# EAGLE design LNShield (EAGLE 8.3.1)

## Sheet 1 of 2: ATMega
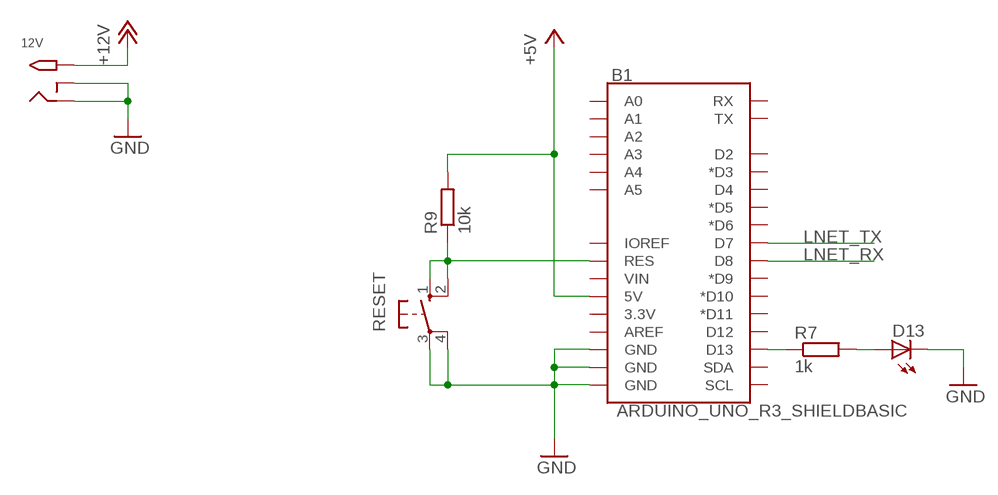
[diagram p0: schematic, sheet 1]

### Parts
12V  2.1MMJACKTHM  [PJ-102A]
B1  ARDUINO_UNO_R3_SHIELDBASIC  [UNO_R3_SHIELD]
D13  LED3MM  [LED3MM]
R7  1k  R-EU_0207/2V  [0207/2V]
R9  10k  R-EU_0207/2V  [0207/2V]
RESET  10-XX  [B3F-10XX]

### Nets
+5V: B1.5V R9.2 ; also sheet 2
+12V [power]: 12V.TIP ; also sheet 2
GND [power]: 12V.RING 12V.RING_SW B1.GND@0(GND) B1.GND@1(GND) B1.GND@2(GND) D13.K(C) RESET.3(P) RESET.4(P1) ; also sheet 2
LNET_RX: B1.D8 ; also sheet 2
LNET_TX: B1.D7 ; also sheet 2
N$2: B1.D13 R7.1
N$4: D13.A R7.2
N$14: B1.RES R9.1 RESET.1(S) RESET.2(S1)
Unconnected: B1.3.3V B1.A0 B1.A1 B1.A2 B1.A3 B1.A4 B1.A5 B1.AREF B1.D2 B1.D3(*D3) B1.D4 B1.D5(*D5) B1.D6(*D6) B1.D9(*D9) B1.D10(*D10) B1.D11(*D11) B1.D12 B1.IOREF B1.RX B1.SCL B1.SDA B1.TX B1.VIN

## Sheet 2 of 2: Loconet interface
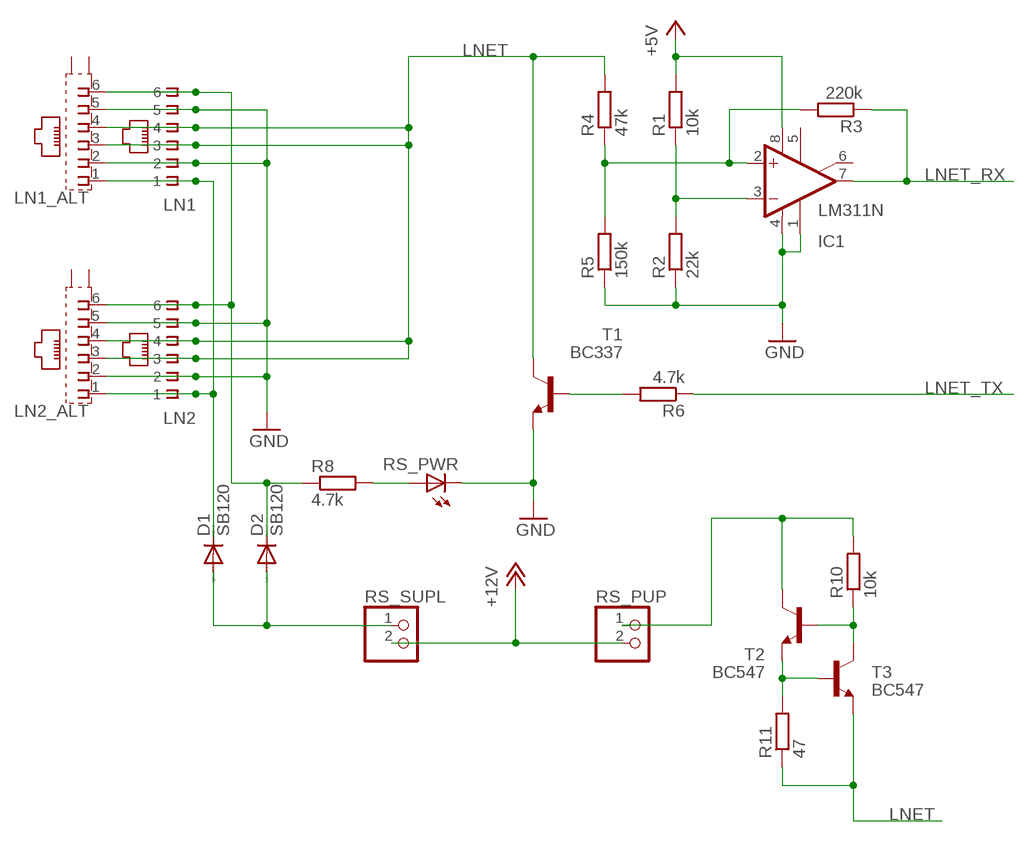
[diagram p1: schematic, sheet 2]

### Parts
D1  SB120  [DO41-10]
D2  SB120  [DO41-10]
IC1  LM311N  [DIL08]
LN1  RJ11-6X  [RJ11-NO_SHIELD]
LN1_ALT  YH-55-10  [YH-55-10]
LN2  RJ11-6X  [RJ11-NO_SHIELD]
LN2_ALT  YH-55-10  [YH-55-10]
R1  10k  R-EU_0207/2V  [0207/2V]
R2  22k  R-EU_0207/2V  [0207/2V]
R3  220k  R-EU_0207/2V  [0207/2V]
R4  47k  R-EU_0207/2V  [0207/2V]
R5  150k  R-EU_0207/2V  [0207/2V]
R6  4.7k  R-EU_0207/2V  [0207/2V]
R8  4.7k  R-EU_0207/2V  [0207/2V]
R10  10k  R-EU_0207/2V  [0207/2V]
R11  47  R-EU_0207/2V  [0207/2V]
RS_PUP  PINHD-1X2  [1X02]
RS_PWR  LED3MM  [LED3MM]
RS_SUPL  PINHD-1X2  [1X02]
T1  BC337  [TO92]
T2  BC547  [TO92]
T3  BC547  [TO92]

### Nets
+5V: IC1.8(V+) R1.2 ; also sheet 1
+12V [power]: RS_PUP.2 RS_SUPL.2 ; also sheet 1
AA [power]: D1.A D2.A RS_SUPL.1
GND [power]: IC1.1(GND) IC1.4(V-) LN1.2 LN1.5 LN1_ALT.2 LN1_ALT.5 LN2.2 LN2.5 LN2_ALT.2 LN2_ALT.5 R2.1 R5.1 RS_PWR.K(C) T1.1(E) ; also sheet 1
LNET: LN1.3 LN1.4 LN1_ALT.3 LN1_ALT.4 LN2.3 LN2.4 LN2_ALT.3 LN2_ALT.4 R4.2 R11.1 T1.3(C) T3.1(E)
LNET_RX: IC1.7(OUT) R3.1 ; also sheet 1
LNET_TX: R6.1 ; also sheet 1
N$1: R6.2 T1.2(B)
N$3: IC1.3(-IN) R1.1 R2.2
N$5: IC1.2(+IN) R3.2 R4.1 R5.2
N$6 [power]: R11.2 T2.1(E) T3.2(B)
N$7 [power]: R8.2 RS_PWR.A
N$9 [power]: R10.1 T2.2(B) T3.3(C)
N$11 [power]: R10.2 RS_PUP.1 T2.3(C)
RAILSYNC_A [power]: D2.C LN1.6 LN1_ALT.6 LN2.6 LN2_ALT.6 R8.1
RAILSYNC_B [power]: D1.C LN1.1 LN1_ALT.1 LN2.1 LN2_ALT.1
Unconnected: IC1.5(ON) IC1.6(ON/STR) LN1_ALT.S1(S) LN1_ALT.S2(S) LN2_ALT.S1(S) LN2_ALT.S2(S)

## Library data of the parts
12V = adafruit:2.1MMJACK: 2.1mm x 5.5mm THM DC jack with internal switch. Digikey part #PJ-102A, 4UCON part #05537 2.1mm x 5.5mm SMT DC jack with internal switch. Digikey part #PJ-002A-SMT, 4UCON part #03267 By microbuilder.eu & adafruit.com
B1 = SparkFun-Boards:ARDUINO_UNO_R3_SHIELD: Arduino R3 Shield Footprint Shield form compatible with the Arduino Uno R3. SparkFun Products: MG2639 Cellular Shield <https://www.sparkfun.com/products/13120> MIDI Shield <https://www.sparkfun.com/products/12898> R3 Stackable Headers Kit <https://www.sparkfun.com/products/11417>
D1 D2 = diode:SB120: DIODE barrier rectifier, 1 A (Fairchild)
D13 RS_PWR = led:LED: LED OSRAM: - CHIPLED LG R971, LG N971, LY N971, LG Q971, LY Q971, LO R971, LY R971 LH N974, LH R974 LS Q976, LO Q976, LY Q976 LO Q996 - Hyper CHIPLED LW Q18S LB Q993, LB Q99A, LB R99A - SideLED LS A670, LO A670, LY A670, LG A670, LP A670 LB A673, LV A673, LT A673, LW A673 LH A674 LY A675 LS A676, LA A676, LO A676, LY A676, LW A676 LS A679, LY A679, LG A679 - Hyper Micro SIDELED® LS Y876, LA Y876, LO Y876, LY Y876 LT Y87S - SmartLED LW L88C, LW L88S LB L89C, LB L89S, LG L890 LS L89K, LO L89K, LY L89K LS L896, LA L896, LO L896, LY L896 - TOPLED LS T670, LO T670, LY T670, LG T670, LP T670 LSG T670, LSP T670, LSY T670, LOP T670, LYG T670 LG T671, LOG T671, LSG T671 LB T673, LV T673, LT T673, LW T673 LH T674 LS T676, LA T676, LO T676, LY T676, LB T676, LH T676, LSB T676, LW T676 LB T67C, LV T67C, LT T67C, LS T67K, LO T67K, LY T67K, LW E67C LS E67B, LA E67B, LO E67B, LY E67B, LB E67C, LV E67C, LT E67C LW T67C LS T679, LY T679, LG T679 LS T770, LO T770, LY T770, LG T770, LP T770 LB T773, LV T773, LT T773, LW T773 LH T774 LS E675, LA E675, LY E675, LS T675 LS T776, LA T776, LO T776, LY T776, LB T776 LHGB T686 LT T68C, LB T68C - Hyper Mini TOPLED® LB M676 - Mini TOPLED Santana® LG M470 LS M47K, LO M47K, LY M47K Source: http://www.osram.convergy.de LUXEON: - LUMILED® LXK2-PW12-R00, LXK2-PW12-S00, LXK2-PW14-U00, LXK2-PW14-V00 LXK2-PM12-R00, LXK2-PM12-S00, LXK2-PM14-U00 LXK2-PE12-Q00, LXK2-PE12-R00, LXK2-PE12-S00, LXK2-PE14-T00, LXK2-PE14-U00 LXK2-PB12-K00, LXK2-PB12-L00, LXK2-PB12-M00, LXK2-PB14-N00, LXK2-PB14-P00, LXK2-PB14-Q00 LXK2-PR12-L00, LXK2-PR12-M00, LXK2-PR14-Q00, LXK2-PR14-R00 LXK2-PD12-Q00, LXK2-PD12-R00, LXK2-PD12-S00 LXK2-PH12-R00, LXK2-PH12-S00 LXK2-PL12-P00, LXK2-PL12-Q00, LXK2-PL12-R00 Source: www.luxeon.com KINGBRIGHT: KA-3528ASYC Source: www.kingbright.com
IC1 = linear:LM311: COMPARATOR
LN1 LN2 = con-tycoelectronics:RJ11: CORCOM Modular RJ Jacks No Shield Source: www.tycoelectronics.com .. ENG_DS_1654001_1099_RJ_L_0507.pdf; MPN: RJ11-6X; OC_FARNELL: unknown; OC_NEWARK: 16R6089
LN1_ALT LN2_ALT = con-wenzhou-yihua:YH-55-10: RJ11 6 connects Source: YH-55-10.pdf; OC_FARNELL: unknown; OC_NEWARK: unknown
R1-R11 = rcl:R-EU_: RESISTOR, European symbol
RESET = switch-omron:10-XX: OMRON SWITCH; MPN: B3F-1000; OC_FARNELL: 176432; OC_NEWARK: 36M3542
RS_PUP RS_SUPL = pinhead:PINHD-1X2: PIN HEADER
T1 = transistor:BC337: NPN TRANSISTOR
T2 T3 = transistor:BC547: NPN TRANSISTOR

## Net classes
0 default: width 0.254 mm
1 power: width 1.016 mm

## Board
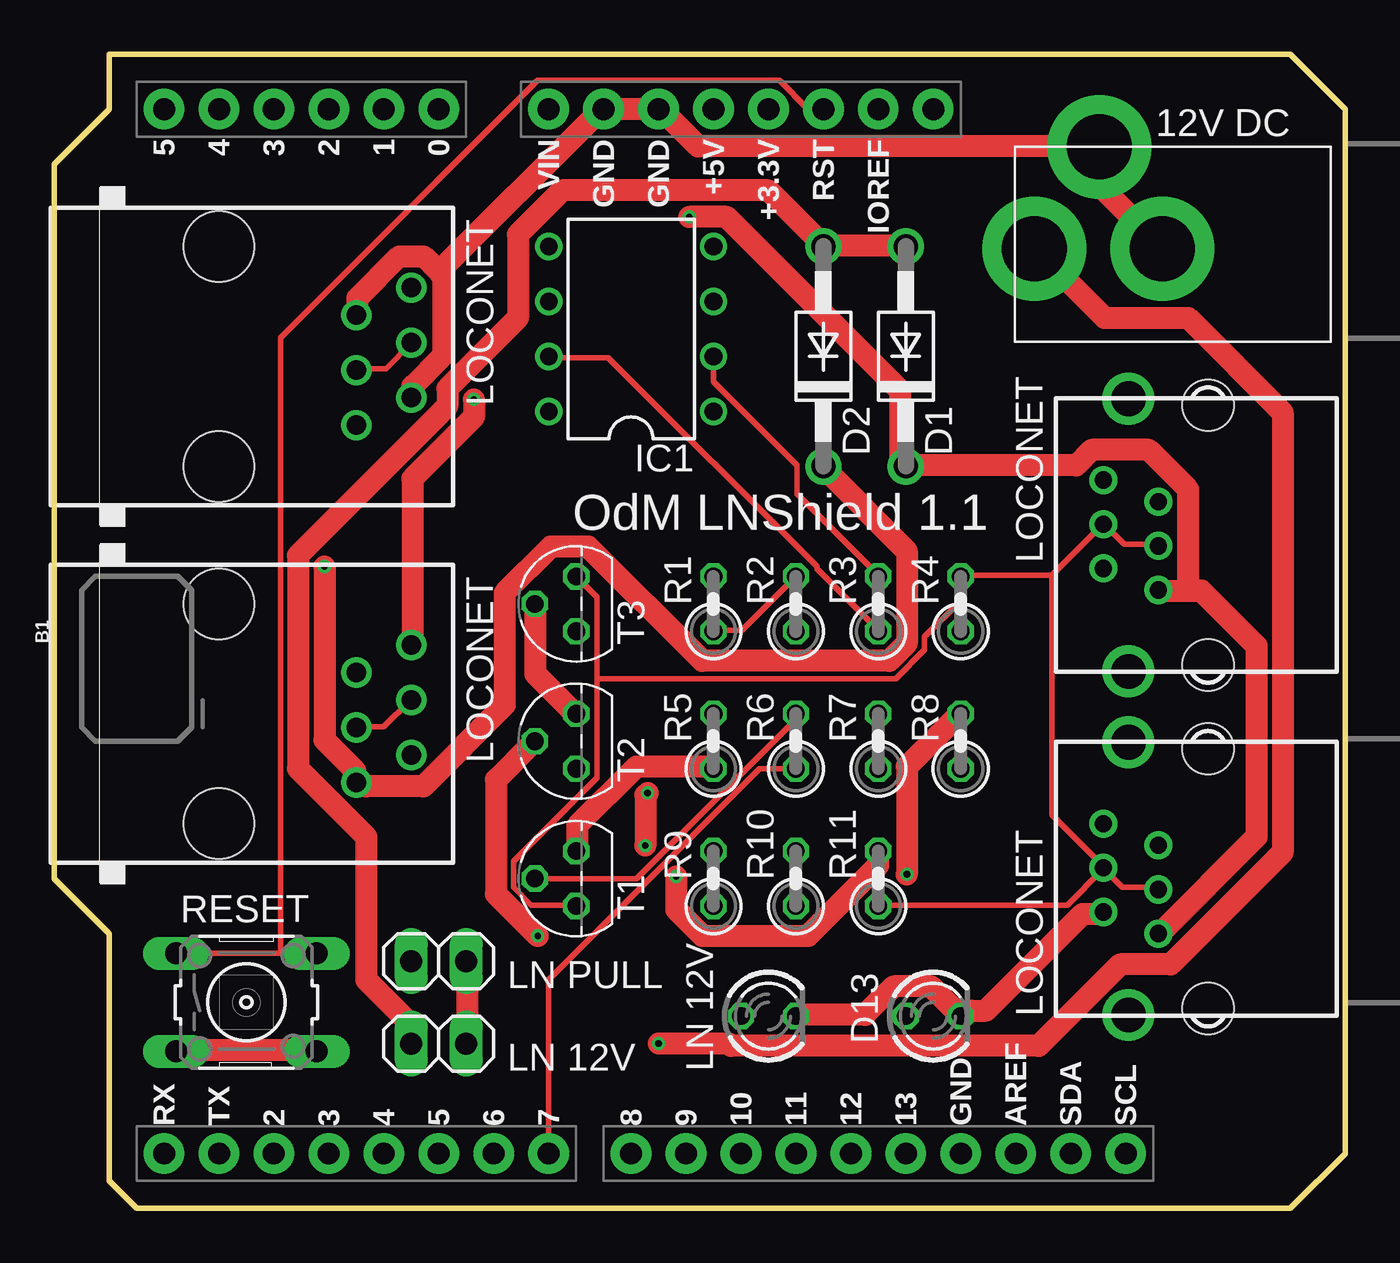
[diagram p2: board, top side]
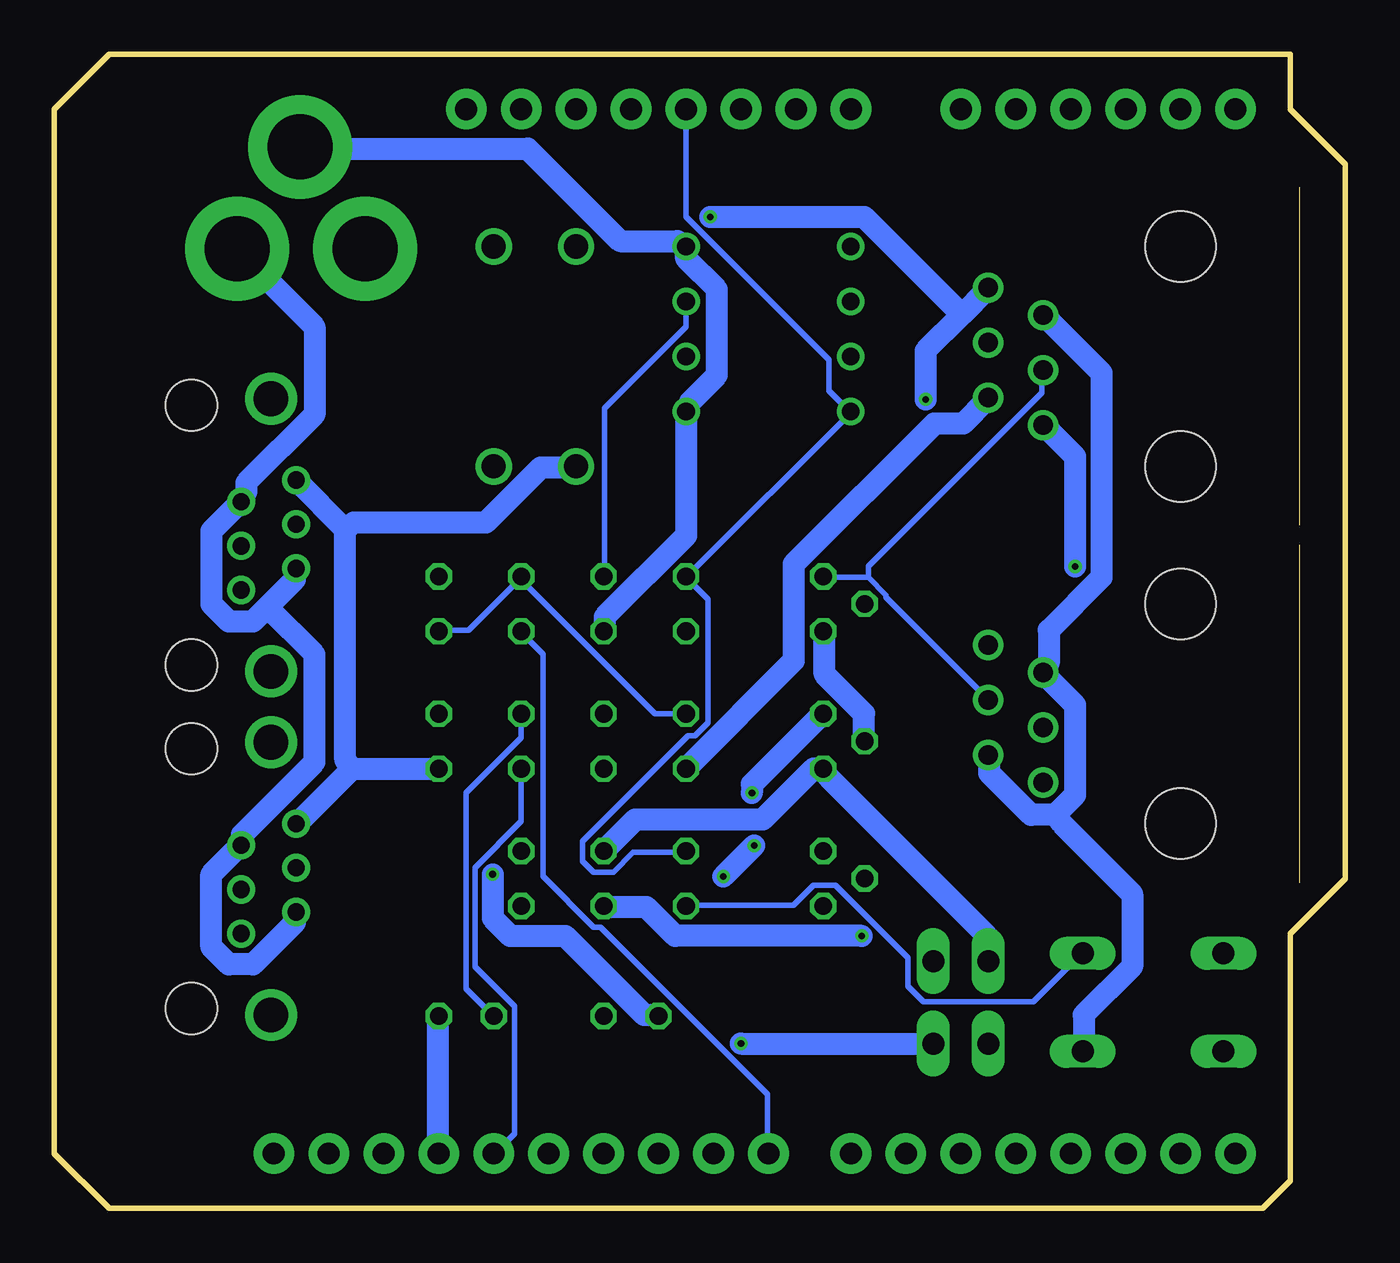
[diagram p3: board, bottom side, seen from below]

Size 59.69 x 53.34 mm. Coordinates in mm from the lower left corner, seen from the top.
Outline: 2.54,53.34 57.15,53.34 59.69,50.8 59.69,2.54 57.15,0 3.81,0 2.54,1.27 2.54,12.7 0,15.24 0,48.26 2.54,50.8 2.54,53.34
Copper layers (1*16): Top 0.035mm / dielectric 1.6mm / Bottom 0.035mm
Design rules "Elecrow_2-layer_PCB_eagle_rule": minimum track width 6mil, minimum drill 12mil, track to track 6mil, track to pad 8mil, pad to pad 12mil, via to via 12mil, smd to smd 0mil, copper to edge 20mil, drill to drill 10mil, minimum pad ring 6mil, minimum via ring 6mil, stop-mask expansion 0mil, vias tented up to drill 100mil, thermal gap 10mil

### Footprints (pad centres in the part's own frame; a part is rotated, then mirrored left to right if it is on the bottom)
PJ-102A = drill 3 pad 4.8: RING 0.1,-3.39; RING_SW -4.6,-6.29; TIP 0.1,-9.29
UNO_R3_SHIELD = drill 1.016 pad 1.88: 3.3V 24.13,-2.54; 5V 24.13,0; A0 24.13,12.7; A1 24.13,15.24; A2 24.13,17.78; A3 24.13,20.32; A4 24.13,22.86; A5 24.13,25.4; AREF -24.13,-13.97; D2 -24.13,20.32; D3 -24.13,17.78; D4 -24.13,15.24; D5 -24.13,12.7; D6 -24.13,10.16; D7 -24.13,7.62; D8 -24.13,3.81; D9 -24.13,1.27; D10 -24.13,-1.27; D11 -24.13,-3.81; D12 -24.13,-6.35; D13 -24.13,-8.89; GND@0 24.13,2.54; GND@1 24.13,5.08; GND@2 -24.13,-11.43; IOREF 24.13,-7.62; NC 24.13,-10.16; RES 24.13,-5.08; RX -24.13,25.4; SCL -24.13,-19.05; SDA -24.13,-16.51; TX -24.13,22.86; VIN 24.13,7.62
DO41-10 = drill 1.118: A 5.08,0; C -5.08,0
LED3MM = drill 0.813 octagon: A -1.27,0; K 1.27,0
DIL08 = drill 0.813 pad 1.27: 1 -3.81,-3.81; 2 -1.27,-3.81; 3 1.27,-3.81; 4 3.81,-3.81; 5 3.81,3.81; 6 1.27,3.81; 7 -1.27,3.81; 8 -3.81,3.81
RJ11-NO_SHIELD = drill 0.9 pad 1.4: 1 -3.175,8.89; 2 -1.905,6.35; 3 -0.635,8.89; 4 0.635,6.35; 5 1.905,8.89; 6 3.175,6.35 | hole 3.251: -5.08,0; 5.08,0
YH-55-10 = drill 0.8 pad 1.3: 1 -2.54,2.3; 2 -1.54,4.84; 3 -0.5,2.3; 4 0.5,4.84; 5 1.54,2.3; 6 2.54,4.84 | drill 1.6 pad 2.184: S1 -6.3,3.68; S2 6.3,3.68 | hole 2.36: -6,0; 6,0
0207/2V = drill 0.813 octagon: 1 -1.27,0; 2 1.27,0
B3F-10XX = drill 1.016 long: 1 -3.251,2.261; 2 3.251,2.261; 3 -3.251,-2.261; 4 3.251,-2.261
1X02 = drill 1.016 long: 1 -1.27,0; 2 1.27,0
TO92 = drill 0.813 octagon: 1 1.27,0; 2 0,1.905; 3 -1.27,0

### Placement (x,y rotation side)
12V  54.61,44.45 270 top
B1  30.48,26.67 90 top
D1  39.37,39.37 90 top
D2  35.56,39.37 90 top
D13  40.64,8.89 0 top
IC1  26.67,40.64 90 top
LN1  7.62,39.37 270 top
LN1_ALT  53.34,31.11 90 top
LN2  7.62,22.86 270 top
LN2_ALT  53.34,15.24 90 top
R1  30.48,27.94 90 top
R2  34.29,27.94 90 top
R3  38.1,27.94 90 top
R4  41.91,27.94 90 top
R5  30.48,21.59 90 top
R6  34.29,21.59 90 top
R7  38.1,21.59 90 top
R8  41.91,21.59 90 top
R9  30.48,15.24 90 top
R10  34.29,15.24 90 top
R11  38.1,15.24 90 top
RESET  8.89,9.53 0 top
RS_PUP  17.78,11.43 0 top
RS_PWR  33.02,8.89 0 top
RS_SUPL  17.78,7.62 0 top
T1  24.13,15.24 90 top
T2  24.13,21.59 90 top
T3  24.13,27.94 90 top

### Tracks (layer width: path | path; a pad name or v marks a point on that pad's centre or on a via)
+5V
  Bottom 0.254: R9.2 30.48,16.46 32.92,16.46 33.83,15.54 34.75,15.54 35.26,16.05 35.26,16.97 30.38,21.84 30.07,21.84 29.46,22.45 29.46,28.14 30.48,29.16 R1.2 30.38,29.26 22.86,36.78 IC1.8 22.96,36.88 23.88,37.8 23.88,39.22 30.48,45.82 B1.5V
+12V  (via drill 0.3)
  Top 1.016: RS_SUPL.2 19.1,7.62 19.1,11.38 RS_PUP.2 | v27.94,7.62 31.19,7.62 31.29,7.52 45.52,7.52 49.28,11.28 51.61,11.28 56.79,16.46 56.79,36.78 52.43,41.15 48.56,41.15 45.41,44.3 12V.TIP
  Bottom 1.016: v27.94,7.62 RS_SUPL.2
AA
  Top 1.016: RS_SUPL.1 16.46,7.62 16.46,8.53 14.43,10.57 14.43,17.17 11.28,20.32 11.28,30.18 18.19,37.08 18.19,37.9 21.44,41.15 21.44,45.01 23.47,47.04 33.02,47.04 35.56,44.5 D2.A 35.97,44.5 39.32,44.5 D1.A
GND
  Top 1.016: RESET.3 5.69,7.32 12.09,7.32 RESET.4 | R5.1 30.38,20.42 26.92,20.42 24.18,17.68 24.18,16.56 T1.1 | 17.78,43.28 17.07,43.99 15.95,43.99 14.02,42.06 14.02,41.35 LN1.2 | 17.78,43.28 17.98,43.08 17.98,39.42 16.56,38 16.56,37.49 LN1.5 | 17.78,43.28 24.99,50.49 B1.GND@1 B1.GND@0 28.35,50.49 29.77,49.07 47.85,49.07 12V.RING_SW 48.36,48.97 48.36,47.24 51.21,44.4 12V.RING | RS_PWR.K 34.34,8.94 37.49,8.94 38.81,10.26 40.54,10.26 D13.K 42.37,9.14 43.08,9.14 47.55,13.61 48.46,13.61 LN2_ALT.2
  Bottom 1.016: 13.41,18.19 14.53,18.19 16.46,20.12 16.46,20.93 LN2.5 | 13.41,18.19 12.5,19.1 12.5,23.27 13.92,24.69 LN2.2 13.72,25.2 13.72,26.72 11.28,29.16 11.28,38.61 13.92,41.25 LN1.2 | RESET.4 12.09,7.32 12.09,8.94 9.86,11.18 9.86,14.53 13.11,17.78 13.41,18.19 | R5.1 25.5,25.3 25.5,29.77 19,36.27 17.68,36.27 16.56,37.39 LN1.5 | 49.84,27.79 50.49,27.13 51.61,27.13 52.43,27.94 52.43,31.29 51.1,32.61 LN1_ALT.5 50.8,33.12 50.8,33.53 47.65,36.68 47.65,40.74 51.21,44.3 12V.RING | 49.84,27.79 48.56,29.06 48.56,29.57 LN1_ALT.2 | LN2_ALT.2 48.56,13.61 48.56,13.21 50.49,11.28 51.61,11.28 52.43,12.09 52.43,15.44 51.1,16.76 LN2_ALT.5 51,17.27 47.65,20.62 47.65,25.6 49.84,27.79 | B1.GND@2 41.96,2.54 41.96,8.84 D13.K | R2.1 34.24,26.72 34.24,27.33 30.48,31.09 IC1.1 30.28,37.29 29.06,38.51 29.06,42.47 30.48,43.89 IC1.4 30.89,44.7 33.53,44.7 37.8,48.97 48.26,48.97 12V.RING_SW
LNET
  Top 0.254: 46.13,29.26 41.96,29.26 R4.2 41.86,29.16 41.86,28.04 40.23,26.42 40.23,25.81 38.91,24.49 25.09,24.49 | 46.13,29.26 48.46,31.6 LN1_ALT.4 48.56,31.6 49.48,30.68 51,30.68 LN1_ALT.3 | R11.1 38.1,14.02 46.84,14.02 48.46,15.65 LN2_ALT.4 | LN2_ALT.3 51,14.83 49.38,14.83 48.56,15.65 LN2_ALT.4 | 46.13,29.26 46.13,18.19 48.46,15.85 LN2_ALT.4 | LN1.4 14.02,38.81 15.34,38.81 16.46,39.93 LN1.3 | LN2.4 14.02,22.25 15.24,22.25 16.46,23.47 LN2.3 | 25.09,24.49 25.09,28.25 T3.1 | 25.09,24.49 25.09,19.91 21.23,16.05 21.23,14.83 22.05,14.02 24.08,14.02 T1.3
  Bottom 0.254: 22.05,29.16 21.23,28.35 21.23,28.25 16.56,23.57 LN2.3 | 22.05,29.16 24.08,29.16 T3.1 | 22.05,29.16 22.05,29.67 14.02,37.69 14.02,38.71 LN1.4
LNET_RX
  Top 0.254: R3.1 38.1,26.72 35.26,29.57 35.26,29.67 25.6,39.32 22.86,39.32 IC1.7
  Bottom 0.254: B1.D8 26.72,2.54 26.72,5.28 34.44,13.01 34.75,13.01 37.08,15.34 37.08,25.6 38.1,26.62 R3.1
LNET_TX
  Top 0.254: R6.1 32.61,20.32 22.86,10.57 B1.D7
N$1
  Top 0.254: T1.2 26.92,15.24 34.24,22.55 34.24,22.86 R6.2
N$2
  Bottom 0.254: R7.1 38.1,17.88 40.23,15.75 40.23,11.18 38.41,9.35 38.41,3.45 39.32,2.54 B1.D13
N$3
  Top 0.254: R2.2 31.8,26.72 30.48,26.72 R1.1
  Bottom 0.254: IC1.3 30.48,40.74 34.24,36.98 34.24,29.26 R2.2
N$4
  Bottom 0.254: R7.2 38.1,21.74 40.64,19.2 40.64,10.16 D13.A
N$5
  Top 0.254: IC1.2 30.48,38.2 34.34,34.34 34.34,33.02 38.1,29.26 R3.2
  Bottom 0.254: R5.2 31.9,22.86 38.1,29.06 R3.2 38.2,29.06 40.54,26.72 41.86,26.72 R4.1
N$6  (via drill 0.3)
  Top 1.016: T3.2 22.25,27.94 22.25,24.69 24.08,22.86 T2.1 | R11.2 38.1,15.85 34.85,12.6 29.97,12.6 28.75,13.82 v28.75,15.34 | v27.33,16.76 27.33,19.1 v27.43,19.2
  Bottom 1.016: v27.33,16.76 v28.75,15.34 | v27.43,19.2 27.43,19.61 24.18,22.86 T2.1
N$7  (via drill 0.3)
  Top 1.016: v39.42,15.44 39.42,20.42 41.86,22.86 R8.2
  Bottom 1.016: v39.42,15.44 39.42,13.41 38.61,12.6 36.07,12.6 32.41,8.94 31.8,8.94 RS_PWR.A
N$9  (via drill 0.3)
  Top 1.016: v22.35,12.6 20.42,14.53 20.42,19.81 22.15,21.54 T2.2
  Bottom 1.016: v22.35,12.6 30.99,12.6 32.31,13.92 34.24,13.92 R10.1 | T3.3 24.08,26.62 24.08,24.69 22.25,22.86 22.25,21.64 T2.2
N$11
  Bottom 1.016: R10.2 32.82,17.98 26.92,17.98 24.59,20.32 T2.3 23.88,19.91 16.56,12.6 16.56,11.48 RS_PUP.1
N$14
  Top 0.254: RESET.2 10.46,11.79 | 10.46,11.79 RESET.1 | B1.RES 34.85,50.8 33.53,52.12 22.35,52.12 10.46,40.23 10.46,11.79
  Bottom 0.254: R9.1 30.48,14.02 25.5,14.02 24.59,14.94 23.57,14.94 20.22,11.58 20.22,10.26 19.51,9.55 14.43,9.55 12.19,11.79 RESET.2
RAILSYNC_A  (via drill 0.3)
  Top 1.016: v12.5,29.67 12.5,21.64 13.92,20.22 13.92,19.71 LN2.6 14.43,19.51 17.07,19.51 20.83,23.27 20.83,28.45 22.96,30.58 24.69,30.58 29.97,25.3 38.61,25.3 39.42,26.11 39.42,30.38 35.56,34.24 D2.C
  Bottom 1.016: v12.5,29.67 12.5,34.75 13.92,36.17 LN1.6 | 45.92,20.32 R8.1 | 45.92,20.32 48.46,17.78 LN2_ALT.6 | 46.23,31.39 48.46,33.63 LN1_ALT.6 | 46.23,31.39 46.23,20.73 45.92,20.32 | D2.C 35.56,34.24 37.19,34.24 39.73,31.7 45.82,31.7 46.23,31.39
RAILSYNC_B  (via drill 0.3)
  Top 1.016: v19.41,37.39 19.41,36.58 16.56,33.73 16.56,26.11 LN2.1 | 52.43,28.55 51.1,28.55 LN1_ALT.1 | 52.43,28.55 53.03,28.55 55.58,26.01 55.58,17.17 51.1,12.7 LN2_ALT.1 | 52.43,28.55 52.43,33.22 50.6,35.05 47.95,35.05 47.24,34.34 39.42,34.34 D1.C 39.12,34.75 39.12,37.8 31.09,45.82 v29.36,45.82
  Bottom 1.016: v19.41,37.39 19.41,39.62 17.73,41.3 | 17.73,41.3 16.56,42.47 LN1.1 | 17.73,41.3 22.25,45.82 v29.36,45.82

### Text on the board
tNames: 12V DC | LOCONET | OdM LNShield 1.1 | LOCONET | LOCONET | LN PULL | LOCONET | D13 | LN 12V | LN 12V